# EAGLE design watch (EAGLE 5.06)
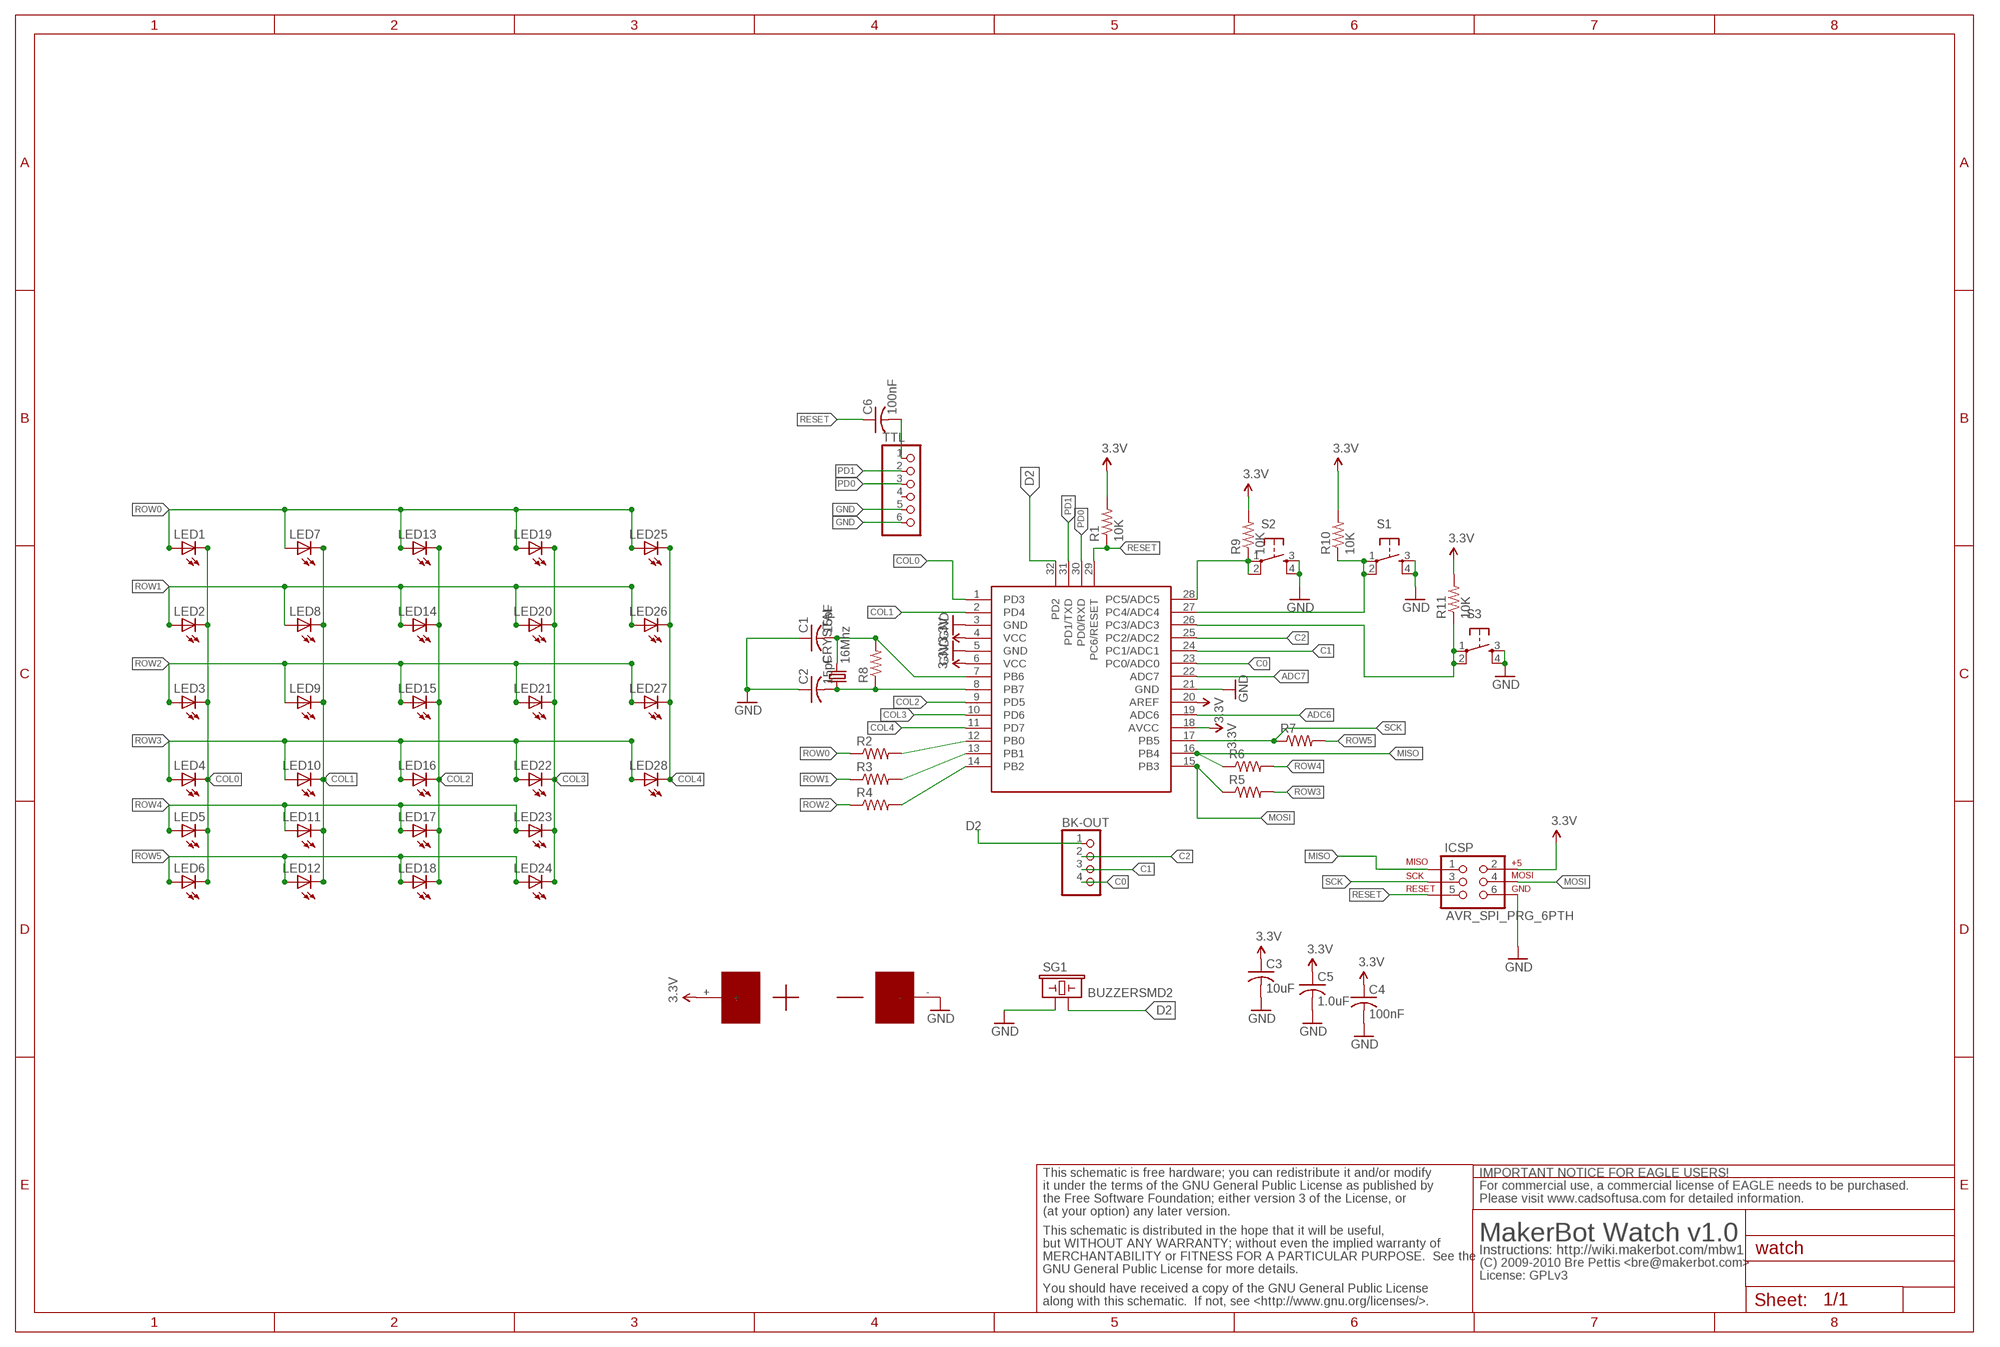
[diagram p0: schematic, sheet 1]

## Parts
BK-OUT  PINHD-1X4  [1X04]
C1  15pF  C-USC1206K  [C1206K]
C2  15pF  C-USC1206K  [C1206K]
C3  10uF  C-USC1206K  [C1206K]
C4  100nF  C-USC1206K  [C1206K]
C5  1.0uF  C-USC1206K  [C1206K]
C6  100nF  C-USC1206K  [C1206K]
CRYSTAL  16Mhz  CRYSTALSMD  [HC49UP]
IC1  ATMEGA328  [TQFP32-08]
ICSP  AVR_SPI_PRG_6PTH  [2X3]
LED1  LED1206  [LED-1206]
LED2  LED1206  [LED-1206]
LED3  LED1206  [LED-1206]
LED4  LED1206  [LED-1206]
LED5  LED1206  [LED-1206]
LED6  LED1206  [LED-1206]
LED7  LED1206  [LED-1206]
LED8  LED1206  [LED-1206]
LED9  LED1206  [LED-1206]
LED10  LED1206  [LED-1206]
LED11  LED1206  [LED-1206]
LED12  LED1206  [LED-1206]
LED13  LED1206  [LED-1206]
LED14  LED1206  [LED-1206]
LED15  LED1206  [LED-1206]
LED16  LED1206  [LED-1206]
LED17  LED1206  [LED-1206]
LED18  LED1206  [LED-1206]
LED19  LED1206  [LED-1206]
LED20  LED1206  [LED-1206]
LED21  LED1206  [LED-1206]
LED22  LED1206  [LED-1206]
LED23  LED1206  [LED-1206]
LED24  LED1206  [LED-1206]
LED25  LED1206  [LED-1206]
LED26  LED1206  [LED-1206]
LED27  LED1206  [LED-1206]
LED28  LED1206  [LED-1206]
R1  10K  RESISTOR  [0805]
R2  RESISTOR  [0805]
R3  RESISTOR  [0805]
R4  RESISTOR  [0805]
R5  RESISTOR  [0805]
R6  RESISTOR  [0805]
R7  RESISTOR  [0805]
R8  RESISTOR  [0805]
R9  10K  RESISTOR  [0805]
R10  10K  RESISTOR  [0805]
R11  10K  RESISTOR  [0805]
S1  TAC_SWITCHSMD  [TACTILE_SWITCH_SMD]
S2  TAC_SWITCHSMD  [TACTILE_SWITCH_SMD]
S3  TAC_SWITCHSMD  [TACTILE_SWITCH_SMD]
SG1  BUZZERSMD2  [BUZZER-CCV]
TTL  PINHD-1X6  [1X06]
U$3  AGAAIN  [AGAIN]

## Nets
3.3V: C3.1 C4.1 C5.1 IC1.4(VCC) IC1.6(VCC) IC1.18(AVCC) IC1.20(AREF) ICSP.2 R1.2 R9.2 R10.2 R11.2 U$3.+
ADC6: IC1.19(ADC6)
ADC7: IC1.22(ADC7)
C0: BK-OUT.4 IC1.23(PC0/ADC0)
C1: BK-OUT.3 IC1.24(PC1/ADC1)
C2: BK-OUT.2 IC1.25(PC2/ADC2)
COL0: IC1.1(PD3) LED1.C LED2.C LED3.C LED4.C LED5.C LED6.C
COL1: IC1.2(PD4) LED7.C LED8.C LED9.C LED10.C LED11.C LED12.C
COL2: IC1.9(PD5) LED13.C LED14.C LED15.C LED16.C LED17.C LED18.C
COL3: IC1.10(PD6) LED19.C LED20.C LED21.C LED22.C LED23.C LED24.C
COL4: IC1.11(PD7) LED25.C LED26.C LED27.C LED28.C
D2: BK-OUT.1 IC1.32(PD2) SG1.-
GND: C1.1 C2.1 C3.2 C4.2 C5.2 IC1.3(GND) IC1.5(GND) IC1.21(GND) ICSP.6 S1.3 S1.4 S2.3 S2.4 S3.3 S3.4 SG1.+ TTL.5 TTL.6 U$3.-
MISO: IC1.16(PB4) ICSP.1 R6.1
MOSI: IC1.15(PB3) ICSP.4 R5.1
N$1: IC1.12(PB0) R2.2
N$2: IC1.13(PB1) R3.2
N$3: IC1.14(PB2) R4.2
N$5: C1.2 CRYSTAL.2 IC1.7(PB6) R8.2
N$8: IC1.28(PC5/ADC5) R9.1 S2.1 S2.2
N$9: IC1.27(PC4/ADC4) R10.1 S1.1 S1.2
N$10: IC1.26(PC3/ADC3) R11.1 S3.1 S3.2
N$12: C6.2 TTL.1
N$23: C2.2 CRYSTAL.1 IC1.8(PB7) R8.1
PD0: IC1.30(PD0/RXD) TTL.3
PD1: IC1.31(PD1/TXD) TTL.2
RESET: C6.1 IC1.29(PC6/RESET) ICSP.5 R1.1
ROW0: LED1.A LED7.A LED13.A LED19.A LED25.A R2.1
ROW1: LED2.A LED8.A LED14.A LED20.A LED26.A R3.1
ROW2: LED3.A LED9.A LED15.A LED21.A LED27.A R4.1
ROW3: LED4.A LED10.A LED16.A LED22.A LED28.A R5.2
ROW4: LED5.A LED11.A LED17.A LED23.A R6.2
ROW5: LED6.A LED12.A LED18.A LED24.A R7.2
SCK: IC1.17(PB5) ICSP.3 R7.1
Unconnected: TTL.4

## Notes on the sheet
- This schematic is free hardware; you can redistribute it and/or modify | IMPORTANT NOTICE FOR EAGLE USERS!
- it under the terms of the GNU General Public License as published by | For commercial use, a commercial license of EAGLE needs to be purchased.
- the Free Software Foundation; either version 3 of the License, or | Please visit www.cadsoftusa.com for detailed information.
- (at your option) any later version.
- This schematic is distributed in the hope that it will be useful,
- MakerBot Watch v1.0
- but WITHOUT ANY WARRANTY; without even the implied warranty of
- Instructions: http://wiki.makerbot.com/mbw1
- MERCHANTABILITY or FITNESS FOR A PARTICULAR PURPOSE.  See the
- (C) 2009-2010 Bre Pettis <bre@makerbot.com>
- GNU General Public License for more details.
- License: GPLv3
- You should have received a copy of the GNU General Public License
- along with this schematic.  If not, see <http://www.gnu.org/licenses/>.

## Library data of the parts
BK-OUT = pinhead:PINHD-1X4: PIN HEADER
C1-C6 = rcl:C-US: CAPACITOR, American symbol
CRYSTAL = sparkFun:CRYSTAL: Crystals Various standard crystals. Proven footprints. Spark Fun Electronics SKU : COM-00534
IC1 = atmega8:ATMEGA328
ICSP = sparkFun:AVR_SPI_PRG_6: AVR ISP 6 Pin This is the reduced ISP connector for AVR programming. Common on Arduino. This footprint will take up less PCB space and can be used with a 10-pin to 6-pin adapter such as SKU: BOB-08508
LED1-LED28 = sparkFun:LED: LEDs Standard schematic elements and footprints for 5mm, 3mm, 1206, and 0603 sized LEDs. 5mm - Spark Fun Electronics SKU : COM-00529 (and others)
R1-R11 = sparkFun:RESISTOR: Resistor Basic schematic elements and footprints for 0603, 1206, and PTH 1/10th watt (small) resistors.
S1-S3 = sparkFun:TAC_SWITCH: Momentary Switch Button commonly used for reset or general input. Spark Fun Electronics SKU : COM-00097
SG1 = sparkFun:BUZZER: Buzzer 12mm Spark Fun Electronics SKU : Comp-Buzzer
TTL = pinhead:PINHD-1X6: PIN HEADER
U$3 = bre:AGAAIN

## Net classes
0 default: width 0.356 mm

## Board
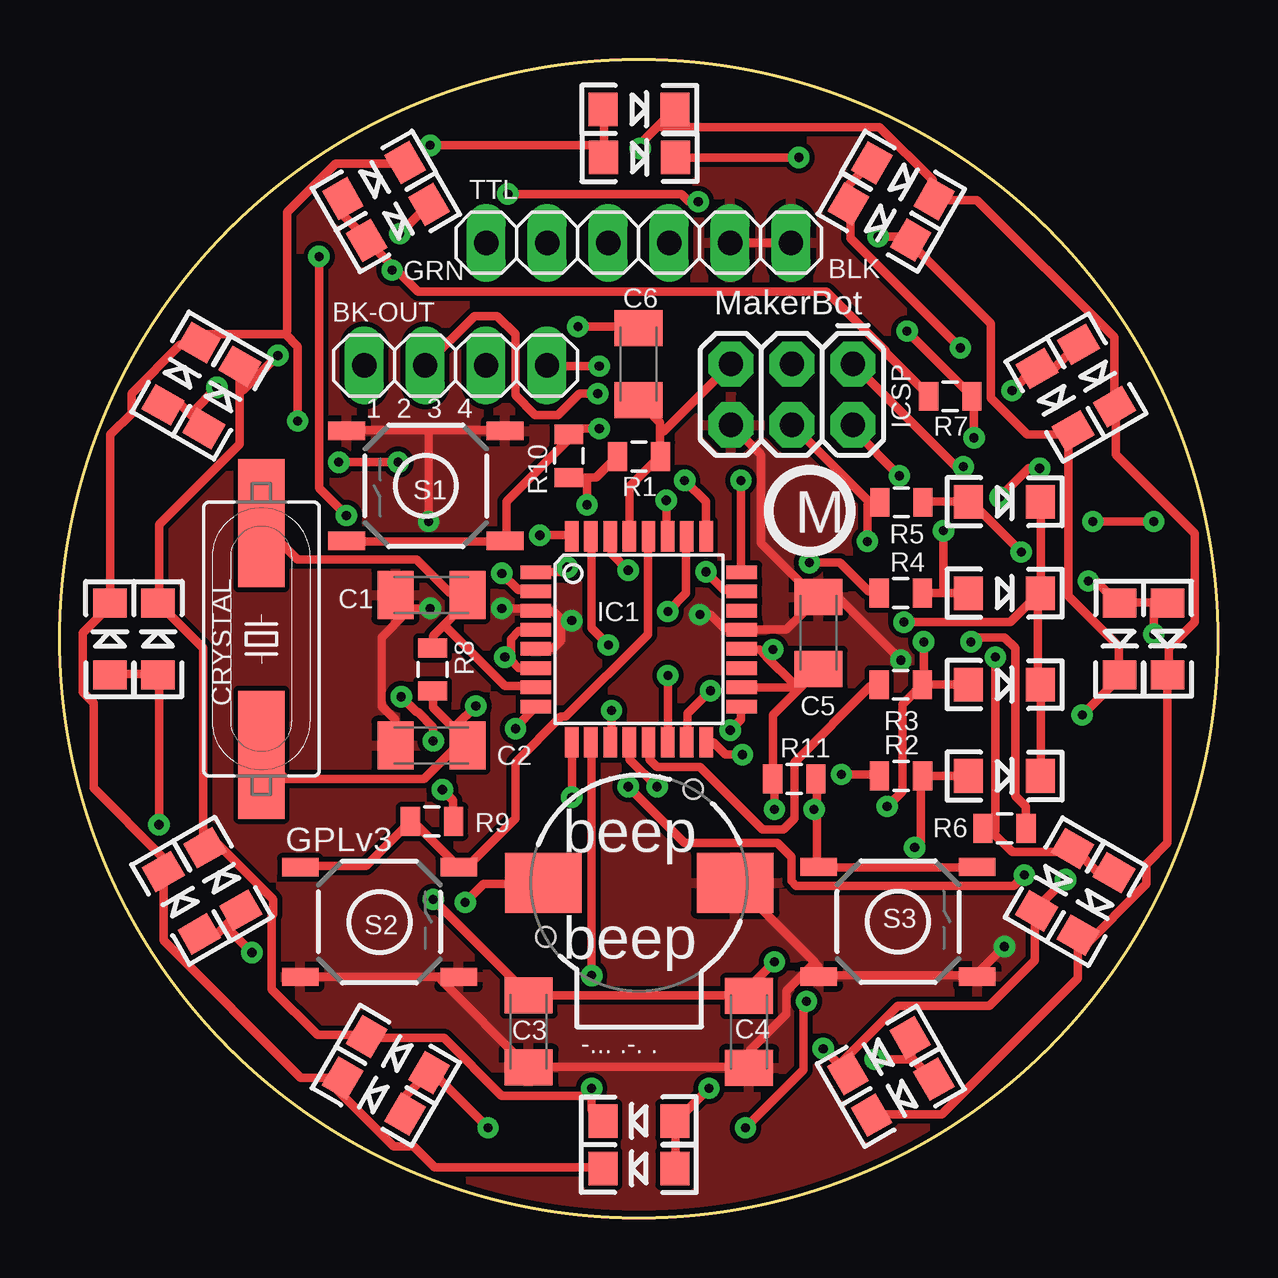
[diagram p1: board, top side]
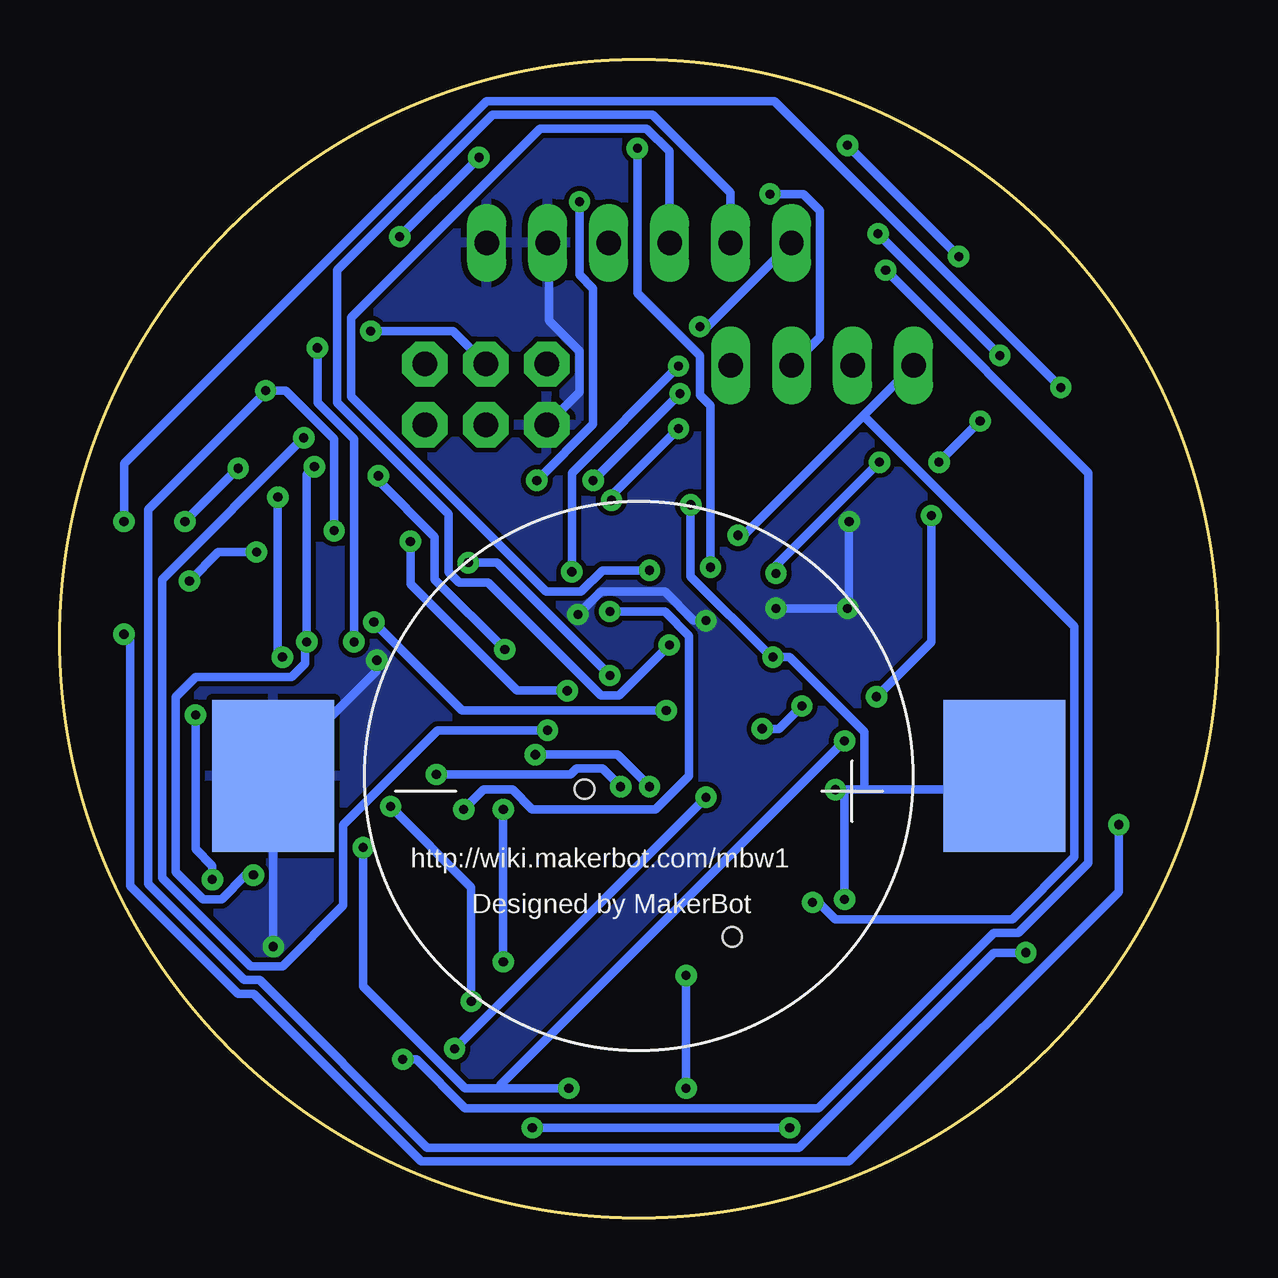
[diagram p2: board, bottom side, seen from below]

Size 48.26 x 48.26 mm. Coordinates in mm from the lower left corner, seen from the top.
Outline: circle at 24.13,24.13 radius 24.13
Copper layers (1*16): Top 0.035mm / dielectric 1.5mm / Bottom 0.035mm
Design rules "SparkFun": minimum track width 8mil, minimum drill 20mil, track to track 8mil, track to pad 8mil, pad to pad 8mil, via to via 8mil, smd to smd 8mil, copper to edge 10mil, drill to drill 8mil, minimum pad ring 12mil, minimum via ring 10mil, stop-mask expansion 4mil, vias tented up to drill 25mil, thermal gap 10mil

### Footprints (pad centres in the part's own frame; a part is rotated, then mirrored left to right if it is on the bottom)
1X04 = drill 1.016 long: 1 -3.81,0; 2 -1.27,0; 3 1.27,0; 4 3.81,0
C1206K = smd 1.5 x 2: 1 -1.5,0; 2 1.5,0
HC49UP = smd 5.334 x 1.93: 1 -4.826,0; 2 4.826,0
TQFP32-08 = smd 1.27 x 0.559: 1 -4.293,2.8; 2 -4.293,2; 3 -4.293,1.2; 4 -4.293,0.4; 5 -4.293,-0.4; 6 -4.293,-1.2; 7 -4.293,-2; 8 -4.293,-2.8; 17 4.293,-2.8; 18 4.293,-2; 19 4.293,-1.2; 20 4.293,-0.4; 21 4.293,0.4; 22 4.293,1.2; 23 4.293,2; 24 4.293,2.8 | smd 0.559 x 1.27: 9 -2.8,-4.293; 10 -2,-4.293; 11 -1.2,-4.293; 12 -0.4,-4.293; 13 0.4,-4.293; 14 1.2,-4.293; 15 2,-4.293; 16 2.8,-4.293; 25 2.8,4.293; 26 2,4.293; 27 1.2,4.293; 28 0.4,4.293; 29 -0.4,4.293; 30 -1.2,4.293; 31 -2,4.293; 32 -2.8,4.293
2X3 = drill 1.016 pad 1.88 octagon: 1 0,0; 2 0,2.54; 3 2.54,0; 4 2.54,2.54; 5 5.08,0; 6 5.08,2.54
LED-1206 = smd 1.2 x 1.4: A -1.5,0; C 1.5,0
0805 = smd 0.8 x 1.2: 1 -0.9,0; 2 0.9,0
TACTILE_SWITCH_SMD = smd 1.524 x 0.762: 1 -3.302,2.286; 2 3.302,2.286; 3 -3.302,-2.286; 4 3.302,-2.286
BUZZER-CCV = smd 3.2 x 2.5: + 4,0; - -4,0 | hole 0.8: -3.9,-2.25; 2.25,3.9
1X06 = drill 1.016 long: 1 -6.35,0; 2 -3.81,0; 3 -1.27,0; 4 1.27,0; 5 3.81,0; 6 6.35,0
AGAIN = smd 5.08 x 6.35: + -15.24,-0.635; - 15.24,-0.635

### Placement (x,y rotation side)
BK-OUT  16.49,35.53 0 top
C1  15.48,25.96 0 top
C2  15.48,19.68 0 top
C3  19.53,7.76 270 top
C4  28.73,7.75 270 top
C5  31.62,24.38 90 top
C6  24.1,35.59 90 top
CRYSTAL  8.4,24.12 90 top
IC1  24.13,24.11 0 top
ICSP  33.05,35.59 180 top
LED1  24.14,46.2 0 top
LED2  35.14,43.23 330 top
LED3  43.21,35.11 300 top
LED4  46.17,24.13 270 top
LED5  43.19,13.08 240 top
LED6  35.13,5.02 210 top
LED7  24.13,2.06 180 top
LED8  13.08,5.07 150 top
LED9  5.05,13.13 120 top
LED10  2.08,24.13 90 top
LED11  5.05,35.18 60 top
LED12  13.09,43.23 30 top
LED13  24.16,44.2 0 top
LED14  34.16,41.51 330 top
LED15  41.48,34.1 300 top
LED16  44.17,24.13 270 top
LED17  41.45,14.09 240 top
LED18  34.14,6.76 210 top
LED19  24.13,4.04 180 top
LED20  14.08,6.8 150 top
LED21  6.78,14.12 120 top
LED22  4.09,24.13 90 top
LED23  6.75,34.2 60 top
LED24  14.08,41.49 30 top
LED25  39.37,18.41 0 top
LED26  39.37,22.23 0 top
LED27  39.37,26.04 0 top
LED28  39.37,29.84 0 top
R1  24.14,31.72 180 top
R2  35.06,18.42 180 top
R3  35.05,22.22 180 top
R4  35.05,26.04 180 top
R5  35.07,29.82 0 top
R6  39.37,16.23 180 top
R7  37.11,34.24 180 top
R8  15.53,22.86 90 top
R9  15.5,16.52 0 top
R10  21.21,31.75 270 top
R11  30.61,18.29 180 top
S1  15.25,30.51 180 top
S2  13.32,12.32 0 top
S3  34.93,12.34 0 top
SG1  24.14,13.96 0 top
TTL  24.12,40.64 0 top
U$3  24.13,17.78 180 bottom

### Tracks (layer width: path | path; a pad name or v marks a point on that pad's centre or on a via)
3.3V  (via drill 0.38)
  Top 0.356: 30.77,22 31.62,22.86 C5.1 | 30.77,22 29.72,20.95 29.72,18.35 R11.2 29.78,18.16 v29.78,17.02 | 30.61,22.1 30.67,22.1 30.77,22 | 30.61,22.1 28.45,22.1 IC1.18 | 29.43,23.4 30.61,22.23 30.61,22.1 | 29.43,23.4 29.15,23.69 28.45,23.69 IC1.20 | v34.99,30.92 33.08,32.83 33.08,33.02 ICSP.2 | v29.72,23.69 29.53,23.5 29.43,23.4 | 21.97,30.86 22.35,30.86 23.18,31.69 R1.2 | 21.97,30.86 21.21,30.86 R10.2 | 18.8,23.37 18.8,24.13 19.11,24.45 19.81,24.45 IC1.4 | 18.8,23.37 18.8,23.24 19.11,22.92 19.81,22.92 IC1.6 | v15.94,17.84 16.38,17.4 16.38,16.57 R9.2 | v18.54,23.37 18.8,23.37 | v21.97,29.72 21.97,30.86 | v15.56,13.27 19.43,9.4 C3.1 19.56,9.27 28.7,9.27 C4.1 28.51,9.4 v29.78,10.67
  Bottom 0.356: v34.99,30.92 34.99,30.73 32.64,28.38 32.64,26.61 v29.72,23.69 | 14.73,17.84 9.46,17.84 U$3.+ | 14.73,17.84 v15.94,17.84 15.56,17.72 v15.56,13.27 | 14.73,17.84 14.73,20.26 17.84,23.37 v18.54,23.37 18.67,23.43 21.97,26.73 v21.97,29.72 | v29.78,10.67 v29.78,17.02
C0  (via drill 0.38)
  Top 0.356: v26.92,26.92 27.69,26.16 28.38,26.16 IC1.23 | v22.48,35.5 20.32,35.5 BK-OUT.4
  Bottom 0.356: v26.92,26.92 26.92,31.05 v22.48,35.5
C1  (via drill 0.38)
  Top 0.356: v28.38,30.73 28.38,26.92 IC1.24 | v26.61,42.35 26.23,42.35 25.91,42.67 v18.67,42.67
  Bottom 0.356: v28.38,30.73 26.04,33.08 26.04,38.73 26.61,39.31 v26.61,42.35 | v18.67,42.67 17.27,42.67 16.57,41.97 16.57,36.7 17.72,35.56 BK-OUT.3
C2  (via drill 0.38)
  Top 0.356: v26.04,30.73 26.92,29.84 26.92,28.45 IC1.25 | v22.42,34.35 21.65,34.35 20.77,33.47 19.81,33.47 18.99,34.29 18.99,36.83 18.22,37.59 17.27,37.59 15.24,35.56 BK-OUT.2
  Bottom 0.356: v22.42,34.35 v26.04,30.73
COL0  (via drill 0.38)
  Top 0.356: LED6.C 33.85,4.32 36.77,4.32 42.42,9.97 42.42,11.75 LED5.C 42.55,11.18 45.28,13.91 45.28,14.73 46.16,15.62 46.16,22.61 LED4.C 46.23,22.8 46.23,23.75 47.31,24.83 47.31,28.51 44.01,31.81 44.01,33.66 LED3.C 43.94,33.85 43.94,36.7 38.23,42.42 36.58,42.42 LED2.C 36.39,42.48 36.39,43.24 34.16,45.47 25.08,45.47 24.99,45.56 | v21.14,27.11 20.95,26.92 19.88,26.92 IC1.1 | v24.19,44.58 24.19,44.77 24.99,45.56 | 24.99,45.56 25.59,46.16 LED1.C | LED6.C | LED6.C 33.85,4.25
  Bottom 0.356: v21.14,27.11 21.14,33.85 21.59,34.29 21.59,35.94 24.19,38.54 v24.19,44.58
COL1  (via drill 0.38)
  Top 0.356: 4.32,14.41 4.32,11.56 10.03,5.84 11.75,5.84 LED8.C | 4.32,14.41 LED9.C | LED7.C 22.61,2.1 15.62,2.1 14.73,2.98 13.91,2.98 11.18,5.71 LED8.C | LED8.C | v18.41,26.86 19.11,26.16 19.81,26.16 IC1.2 | v11.62,31.5 v14.1,31.5 | v9.91,33.21 9.91,36.32 9.4,36.83 | 9.4,36.83 6.16,36.83 5.84,36.51 LED11.C | LED11.C 5.65,36.39 5.02,36.39 2.98,34.35 2.98,33.53 2.1,32.64 2.1,25.65 LED10.C 2.03,25.46 0.95,24.38 0.95,21.91 1.4,21.46 1.4,17.91 4.25,15.05 4.25,14.61 LED9.C | LED12.C 14.35,43.94 11.49,43.94 9.46,41.91 9.46,36.96 9.4,36.83 | LED9.C | LED9.C 4.32,14.48 4.32,14.41 | LED11.C
  Bottom 0.356: v18.41,26.86 18.41,27.18 v14.1,31.5 | v9.91,33.21 v11.62,31.5
COL2  (via drill 0.38)
  Top 0.356: v21.34,17.53 IC1.9 | v31.81,7.05 32.83,6.03 LED18.C | LED18.C | LED18.C 32.58,6.48 34.92,8.83 38.73,8.83 40.64,10.73 40.64,12.76 LED17.C 40.77,12.95 v41.91,14.1 | v34.1,40.89 35.31,40.89 35.43,40.77 LED14.C 35.5,40.58 38.8,37.27 38.8,34.16 40.32,32.64 41.91,32.64 LED15.C 42.23,32.77 42.04,32.58 42.04,25.91 44.13,23.81 44.13,22.67 LED16.C 44.13,22.48 v42.61,20.95 | v30.8,44.2 LED13.C
  Bottom 0.356: v31.81,7.05 v21.34,17.53 | v34.1,40.89 v30.8,44.2 | v41.91,14.1 41.91,14.67 42.61,15.37 v42.61,20.95
COL3  (via drill 0.38)
  Top 0.356: v22.16,10.1 22.16,19.81 IC1.10 | LED19.C 22.61,4.06 22.16,4.51 v22.16,5.4 22.04,5.08 18.41,5.08 16,7.49 12.83,7.49 LED20.C | LED21.C 5.97,15.43 5.97,23.75 4.13,25.59 LED22.C 4.13,25.78 4.13,28.89 7.49,32.26 7.49,34.48 | 7.49,34.48 7.49,35.43 | 7.49,35.43 LED23.C | LED23.C | v14.16,41.02 15.37,42.23 LED24.C | v9.08,35.94 7.62,34.48 7.49,34.48 | LED20.C 12.64,7.62 10.73,7.62 8.83,9.53 8.83,12.57 8.89,12.64 8.89,13.27 6.1,16.07 LED21.C | LED21.C | LED21.C | LED20.C | LED20.C 12.83,7.56 | LED21.C | LED23.C 7.49,35.43
  Bottom 0.356: v22.16,5.4 v22.16,10.1 | v9.08,35.94 v14.16,41.02
COL4  (via drill 0.38)
  Top 0.356: LED25.C 40.89,18.41 40.89,22.23 LED26.C 40.77,22.35 40.77,25.78 LED27.C | v22.99,21.14 22.99,19.88 IC1.11 | v35.18,24.83 39.62,24.83 40.83,26.04 LED27.C | LED28.C 40.89,29.84 40.89,26.16 LED27.C
  Bottom 0.356: v22.99,21.14 31.5,21.14 v35.18,24.83
D2  (via drill 0.38)
  Top 0.356: v20,28.45 21.27,28.45 IC1.32 | v16.89,13.14 17.65,13.91 20.13,13.91 SG1.-
  Bottom 0.356: v20,28.45 19.75,28.45 14.76,33.43 | 14.76,33.43 12.7,35.5 BK-OUT.1 | v16.89,13.14 16.64,13.14 15.94,12.45 8.57,12.45 5.97,15.05 5.97,24.64 14.67,33.34 14.76,33.43
GND  (via drill 0.38)
  Top 0.356: 15.37,32.83 18.54,32.83 S1.3 | 15.37,32.83 12,32.83 S1.4 | 20.89,24.89 20.89,24.96 20.57,25.27 19.88,25.27 IC1.3 19.68,25.4 v18.41,25.4 | 20.89,24.89 20.89,24.07 20.57,23.75 19.88,23.75 IC1.5 | v15.43,25.4 14.54,25.4 14.03,25.91 C1.1 14.48,25.27 13.4,24.19 13.4,21.34 13.97,20.77 C2.1 | v15.37,29.02 15.37,32.83 | TTL.5 TTL.6 | C5.2 31.62,25.84 30.29,24.51 28.45,24.51 IC1.21 28.26,24.57 27.69,24.57 27.11,25.15 v26.67,25.15 | C5.2 31.5,25.97 31.37,25.97 29.21,28.13 29.21,31.81 28,33.02 ICSP.6 | v21.34,24.89 20.89,24.89 | S2.3 10.03,10.03 16.57,10.03 S2.4 15.88,9.91 19.49,6.29 C3.2 19.68,6.29 28.57,6.29 C4.2 28.77,6.29 28.77,6.99 30.29,8.51 30.29,9.46 31.37,10.54 31.46,10.64 | 31.46,10.64 28.19,13.91 SG1.+ | 31.46,10.64 31.62,10.48 31.62,10.1 S3.3 31.75,10.1 38.23,10.1 S3.4 38.29,10.22 v39.37,11.3 | v35.05,23.24 32.51,25.78 31.75,25.78 C5.2
  Bottom 0.356: v18.41,25.4 v15.43,25.4 15.37,25.53 v15.37,29.02 | TTL.5 27.88,40.64 27.88,37.4 26.61,36.13 26.61,34.42 27.94,33.08 ICSP.6 | v21.34,24.89 21.84,24.89 23.05,26.1 25.72,26.1 v26.67,25.15 | v39.37,11.3 U$3.- 39.31,18.54 35.05,22.8 v35.05,23.24
  pour Top: -1.78,48.26 50.04,49.28 50.04,-0.51 -1.78,-1.52
  pour Bottom: -3.81,49.28 51.05,50.29 51.05,-1.52 -3.81,-2.54
MISO  (via drill 0.38)
  Top 0.356: v37.97,24 38.16,24.19 39.37,24.19 39.81,23.75 39.81,17.59 40.26,17.14 40.26,16.26 R6.1 | v37.66,31.3 37.34,31.3 33.08,35.56 ICSP.1 | v28.45,19.3 27.75,19.3 27.24,19.81 26.99,19.81 IC1.16 | v23.69,17.97 26.04,15.62 29.91,15.62 30.48,15.05 30.48,14.03 30.67,13.84 39.75,13.84 v40.2,14.29
  Bottom 0.356: v37.66,31.3 37.97,30.99 v37.97,24 38.04,23.88 38.04,23.11 38.61,22.54 42.61,22.54 43.43,21.72 43.43,14.41 42.29,13.27 41.53,13.27 40.51,14.29 v40.2,14.29 | v28.45,19.3 25.02,19.3 v23.69,17.97
MOSI  (via drill 0.38)
  Top 0.356: 33.72,29.84 34.16,29.84 R5.1 | 33.72,29.84 30.54,33.02 ICSP.4 | v27.11,21.97 26.16,21.02 26.16,19.88 IC1.15 | v33.66,28.19 33.66,29.72 33.72,29.84
  Bottom 0.356: v27.11,21.97 29.21,21.97 33.66,26.42 v33.66,28.19
N$1  (via drill 0.38)
  Top 0.356: v32.58,18.48 34.1,18.48 R2.2 | v24.89,17.97 23.75,19.11 23.75,19.81 IC1.12
  Bottom 0.356: v32.58,18.48 26.99,18.48 26.73,18.73 25.65,18.73 v24.89,17.97
N$2
  Top 0.356: R3.2 34.1,22.16 33.78,22.16 30.61,18.99 30.61,16.64 30.16,16.19 29.27,16.19 26.67,18.8 24.89,18.8 24.57,19.11 24.57,19.81 IC1.13
N$3  (via drill 0.38)
  Top 0.356: v31.24,27.3 32.51,27.3 33.72,26.1 34.1,26.1 R4.2 | v25.34,22.61 25.34,19.88 IC1.14
  Bottom 0.356: v31.24,27.3 30.04,27.3 v25.34,22.61
N$5
  Top 0.356: 16,24.7 16.95,25.65 16.95,25.91 C1.2 16.83,26.04 16.26,26.04 14.86,27.43 9.91,27.43 8.45,28.89 CRYSTAL.2 | 16,24.7 15.56,24.26 15.56,23.81 R8.2 | IC1.7 19.81,22.16 18.54,22.16 16,24.7
N$8
  Top 0.356: IC1.28 24.51,28.38 24.51,24.32 21.08,20.89 20.89,20.89 18.99,18.99 18.99,16.64 17.02,14.67 16.76,14.67 S2.2 16.57,14.67 14.73,16.51 R9.1 14.48,16.38 12.76,14.67 10.03,14.67 S2.1
N$9  (via drill 0.38)
  Top 0.356: v25.27,29.91 25.27,28.45 IC1.27 | v22.48,32.89 21.46,32.89 21.34,32.77 R10.1 21.14,32.64 21.14,32.38 18.61,29.84 18.61,28.26 S1.1 18.41,28.19 12,28.19 S1.2
  Bottom 0.356: v25.27,29.91 25.27,30.1 v22.48,32.89
N$10  (via drill 0.38)
  Top 0.356: 31.56,17.02 31.56,14.73 31.62,14.67 S3.1 31.75,14.61 38.23,14.61 S3.2 | 31.56,17.02 31.56,18.29 R11.1 | v25.34,25.27 26.1,26.04 26.1,28.38 IC1.26 | v31.43,17.02 31.56,17.02
  Bottom 0.356: v25.34,25.27 23.05,25.27 22.04,24.26 22.04,18.41 23.43,17.02 28.57,17.02 29.4,17.84 30.61,17.84 v31.43,17.02
N$12  (via drill 0.38)
  Top 0.356: v21.59,37.15 24.07,37.15 C6.2
  Bottom 0.356: v21.59,37.15 21.27,37.15 TTL.1
N$23  (via drill 0.38)
  Top 0.356: R8.1 15.56,21.91 15.56,21.27 16.95,19.88 16.95,19.68 C2.2 | v18.99,20.38 18.99,20.45 19.81,21.27 IC1.8 | v17.34,21.34 16.51,20.51 C2.2 | C2.2 16.76,19.75 16.64,19.75 15.18,18.29 9.4,18.29 8.45,19.24 CRYSTAL.1
  Bottom 0.356: v18.99,20.38 18.29,20.38 v17.34,21.34
PD0  (via drill 0.38)
  Top 0.356: v23.69,26.99 22.99,27.69 22.99,28.38 IC1.30
  Bottom 0.356: v23.69,26.99 25.65,26.99 26.54,26.1 28,26.1 36.13,34.23 36.13,37.53 28.26,45.4 23.81,45.4 22.86,44.45 TTL.3
PD1  (via drill 0.38)
  Top 0.356: v22.86,23.88 22.16,24.57 22.16,28.38 IC1.31
  Bottom 0.356: v22.86,23.88 24.96,21.78 25.72,21.78 30.42,26.48 31.62,26.48 32.07,26.92 32.07,29.34 36.7,33.97 36.7,39.5 30.23,45.97 23.56,45.97 20.32,42.74 TTL.2
RESET
  Top 0.356: 25.02,32.77 25.02,33.15 24.13,34.04 C6.1 | 25.02,32.77 25.02,31.75 R1.1 24.89,31.62 23.75,30.48 23.75,28.45 IC1.29 | ICSP.5 25.15,32.77 25.02,32.77
ROW0  (via drill 0.38)
  Top 0.356: LED1.A 22.67,46.16 LED13.A 22.54,44.7 v15.43,44.7 | LED25.A 36.01,18.41 R2.1 35.88,18.29 35.88,15.68 v35.62,15.43 | LED7.A 25.65,2.1 25.65,4 LED19.A 25.78,4.13 v27.05,5.4 | v10.79,40.07 10.79,30.42 v11.94,29.27 | v14.22,21.72 14.86,21.08 14.92,21.08 15.56,20.45 v15.56,19.88
  Bottom 0.356: v35.62,15.43 35.62,9.65 31.37,5.4 29.91,5.4 | v27.05,5.4 29.91,5.4 | v10.79,40.07 v15.43,44.7 | v11.94,29.27 11.94,24 v14.22,21.72 | v15.56,19.88 29.91,5.52 29.91,5.4
ROW1  (via drill 0.38)
  Top 0.356: LED8.A 14.41,4.38 14.41,5.08 15.37,6.03 LED20.A 15.56,6.03 v17.84,3.75 | R3.1 36.01,22.23 LED26.A | LED2.A 33.78,43.94 32.89,43.05 32.89,42.29 LED14.A | v36.01,24 36.01,22.35 R3.1 | v37.53,36.26 32.96,40.83 32.96,42.1 LED14.A | v28.57,3.75 30.99,6.16 30.99,8.89 v31.11,9.02 | v34.48,17.14 35.12,17.78 35.12,21.4 35.81,22.1 R3.1 | LED14.A
  Bottom 0.356: v36.01,24 36.01,32.45 37.53,33.97 v37.53,36.26 | v17.84,3.75 v28.57,3.75 | v31.11,9.02 31.11,13.78 v34.48,17.14
ROW2  (via drill 0.38)
  Top 0.356: 6.89,12.16 7.49,12.76 LED21.A | 6.89,12.16 6.6,11.87 5.84,11.87 LED9.A | 36.83,26.04 36.01,26.04 R4.1 | 36.83,26.04 LED27.A | LED15.A 40.77,35.43 41.47,35.43 42.42,36.39 LED3.A | LED3.A | v39.69,34.48 40.58,35.37 | v36.83,28.64 36.83,26.04 | 40.58,35.37 LED15.A | LED15.A | v8,11.05 6.99,12.06 6.89,12.16 | LED15.A 40.7,35.43 40.58,35.37
  Bottom 0.356: v36.83,28.64 36.83,32.45 38.86,34.48 v39.69,34.48 39.75,34.35 44.58,29.53 44.58,13.91 40.58,9.91 39.94,9.91 32.96,2.92 17.46,2.92 9.34,11.05 v8,11.05
ROW3  (via drill 0.38)
  Top 0.356: LED10.A 2.1,22.67 4.06,22.67 LED22.A 4.13,22.48 v4.13,16.38 | R5.2 36.01,29.84 LED28.A 38.04,29.78 v40.07,27.75 | v42.86,26.54 43.18,26.54 44.01,25.72 LED16.A 44.2,25.65 46.16,25.65 LED4.A 45.59,25.53 v45.59,24.32
  Bottom 0.356: v40.07,27.75 41.66,27.75 v42.86,26.54 | v4.13,16.38 4.13,13.59 15.37,2.35 33.21,2.35 40.2,9.34 40.83,9.34 45.34,13.84 45.34,24.07 v45.59,24.32
ROW4  (via drill 0.38)
  Top 0.356: 5.43,33.5 5.97,32.96 LED23.A | 5.43,33.5 5.08,33.85 4.32,33.85 LED11.A | 38.89,16.03 39.69,15.24 42.04,15.24 42.16,15.37 | 38.89,16.03 38.73,16.19 38.48,16.19 R6.2 | 42.16,15.37 LED17.A | LED5.A | LED17.A | LED17.A 42.35,15.3 43.24,14.41 43.88,14.41 LED5.A | v6.54,34.61 5.52,33.59 5.43,33.5 | v45.59,29.02 v43.05,29.02 | v40.83,31.24 40.39,31.24 v39.18,30.04 | v38.99,23.37 38.99,16.13 38.89,16.03 | LED17.A 42.23,15.43 42.16,15.37
  Bottom 0.356: v6.54,34.61 18.48,46.55 30.48,46.55 45.59,31.43 v45.59,29.02 | v43.05,29.02 v40.83,31.24 | v39.18,30.04 39.18,23.56 v38.99,23.37
ROW5  (via drill 0.38)
  Top 0.356: 35.5,6.67 35.5,7.49 LED18.A | 35.5,6.67 36.39,5.78 LED6.A | 13.94,39.59 12.83,40.7 LED24.A 12.7,40.89 11.81,41.78 11.81,42.42 LED12.A | 13.94,39.59 14.92,38.61 31.94,38.61 34.42,36.13 34.42,36.07 36.2,34.29 R7.2 | v33.97,6.6 35.37,6.6 35.5,6.67 | v13.84,39.5 13.94,39.59
  Bottom 0.356: v33.97,6.6 33.4,6.6 31.37,4.57 16.64,4.57 9.34,11.87 8.32,11.87 5.4,14.8 5.4,31.05 v13.84,39.5
SCK  (via drill 0.38)
  Top 0.356: v35.31,36.96 37.97,34.29 R7.1 38.1,34.1 v38.1,32.51 | v27.94,20.32 28.38,20.77 28.38,21.27 IC1.17
  Bottom 0.356: v35.31,36.96 31.88,36.96 ICSP.3 | v27.94,20.32 32.51,20.32 36.45,16.38 36.45,13.02 38.99,10.48 40.32,10.48 44.01,14.16 44.01,26.61 v38.1,32.51

### Text on the board
tPlace: GRN | BLK | MakerBot | 1 2 3 4 | M | GPLv3 | beep | beep | -... .-. .
bPlace: http://wiki.makerbot.com/mbw1 | Designed by MakerBot